# EAGLE design L298_gen_card2007 (EAGLE 4.16)
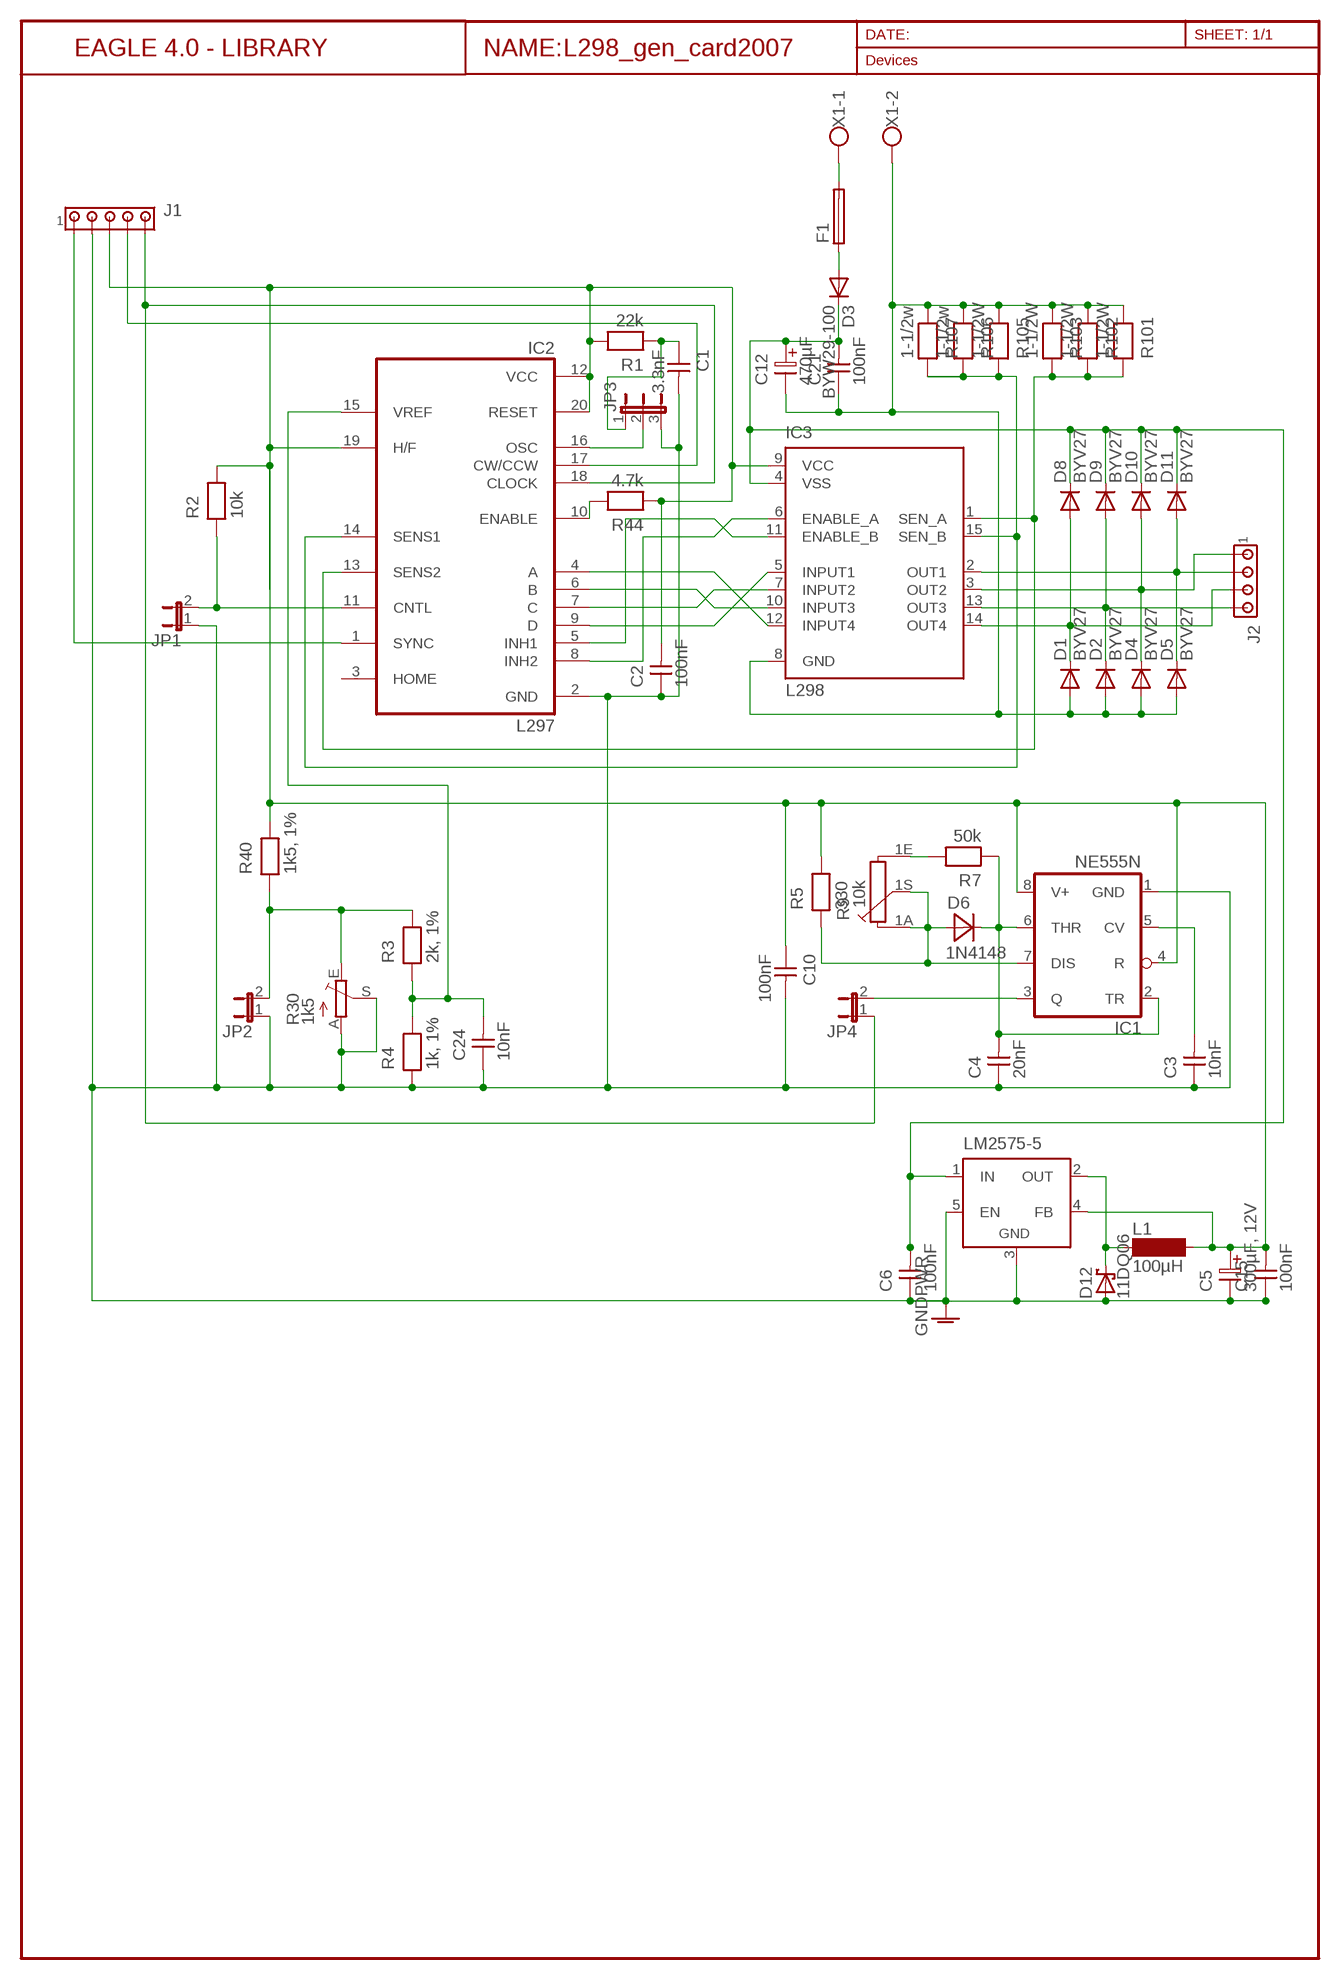
[diagram p0: schematic, sheet 1]

## Parts
C1  3.3nF  CAPNP-5  [C-5]
C2  100nF  CAPNP-5  [C-5]
C3  10nF  CAPNP-5  [C-5]
C4  20nF  CAPNP-5  [C-5]
C5  300µF, 12V  ELC-5  [ES-5]
C6  100nF  CAPNP-5  [C-5]
C10  100nF  CAPNP-5  [C-5]
C12  470µF  ELC-5L  [ES-5L]
C15  100nF  CAPNP-5  [C-5]
C21  100nF  CAPNP-5  [C-5]
C24  10nF  CAPNP-5  [C-5]
D1  BYV27  [SOD57-10]
D2  BYV27  [SOD57-10]
D3  BYW29-100  BYW29  [DO220S]
D4  BYV27  [SOD57-10]
D5  BYV27  [SOD57-10]
D6  1N4148  DIODE-7,5  [D-7,5]
D8  BYV27  [SOD57-10]
D9  BYV27  [SOD57-10]
D10  BYV27  [SOD57-10]
D11  BYV27  [SOD57-10]
D12  11DQ06  SCHOTTKY-DIODEF126Z12  [F126Z12]
F1  TE5  [TE5]
IC1  NE555N  [DIL08]
IC2  L297  [DIL20]
IC3  L298  [MULTIWATT-15]
J1  MTA05-100  [10X05MTA]
J2  MTA04-100  [10X04MTA]
JP1  JP1E  [JP1]
JP2  JP1E  [JP1]
JP3  JP2EROUND  [JP2R]
JP4  JP1E  [JP1]
L1  100µH  BS75  [BS75]
LM2575-5  LM2596TV  [TO220-51]
R1  22k  RESEU-7,5-10  [R-10]
R2  10k  RESEU-10  [R-10]
R3  2k, 1%  RESEU-10  [R-10]
R4  1k, 1%  RESEU-10  [R-10]
R5  330  RESEU-7,5-10  [R-10]
R7  50k  RESEU-7,5-10  [R-10]
R9  10k  PC16S  [PC16S]
R30  1k5  TRIM_EU-S64W  [S64W]
R40  1k5, 1%  RESEU-7,5-10  [R-10]
R44  4.7k  RESEU-7,5-10  [R-10]
R101  1-1/2W  RESEU-10  [R-10]
R102  1-1/2W  RESEU-10  [R-10]
R103  1-1/2W  RESEU-10  [R-10]
R105  1-1/2W  RESEU-10  [R-10]
R106  1-1/2w  RESEU-10  [R-10]
R107  1-1/2w  RESEU-10  [R-10]
X1  AK500/2  [AK500/2]

## Nets
A: D1.C D8.A IC3.14(OUT4) J2.3
B: D2.C D9.A IC3.13(OUT3) J2.4
C: D4.C D10.A IC3.3(OUT2) J2.1
CLK: IC2.18(CLOCK) J1.5 JP4.1
CLOCK: IC1.3(Q) JP4.2
CTRL [MEDIUM]: IC2.11(CNTL) JP1.2 R2.1
CW: IC2.17(CW/CCW) J1.4
D: D5.C D11.A IC3.2(OUT1) J2.2
GND: C1.2 C2.1 C3.1 C4.1 C5.2 C6.1 C10.2 C12.2 C15.1 C21.1 C24.1 D1.A D2.A D4.A D5.A D12.A IC1.1(GND) IC2.2(GND) IC3.8(GND) J1.2 JP1.1 JP2.1 JP3.3 LM2575-5.3(GND) LM2575-5.5(EN) R4.1 R30.A R30.S R101.2 R102.2 R103.2 R105.2 R106.2 R107.2 X1.2 ; supply symbol labelled GNDPWR
INH_1: IC2.5(INH1) IC3.11(ENABLE_B)
INH_2: IC2.8(INH2) IC3.6(ENABLE_A)
N$1: D3.A F1.1
N$2: F1.2 X1.1
N$4: D6.1(A) IC1.7(DIS) R5.1 R9.1A R9.1S
N$9: R7.2 R9.1E
N$10: C3.2 IC1.5(CV)
N$11: IC2.10(ENABLE) R44.2
N$12: IC2.16(OSC) JP3.2
N$15: C1.1 JP3.1 R1.1
N$20: C4.2 D6.2(K) IC1.2(TR) IC1.6(THR) R7.1
N$22: D12.C L1.1 LM2575-5.2(OUT)
SENSE_1: IC2.14(SENS1) IC3.15(SEN_B) R105.1 R106.1 R107.1
SENSE_2: IC2.13(SENS2) IC3.1(SEN_A) R101.1 R102.1 R103.1
SIG_A: IC2.4(A) IC3.12(INPUT4)
SIG_B: IC2.6(B) IC3.10(INPUT3)
SIG_C: IC2.7(C) IC3.7(INPUT2)
SIG_D: IC2.9(D) IC3.5(INPUT1)
SYNC: IC2.1(SYNC) J1.1
VCC [MEDIUM]: C2.2 C5.1 C10.1 C15.2 IC1.4(R) IC1.8(V+) IC2.12(VCC) IC2.19(H/F) IC2.20(RESET) IC3.9(VCC) J1.3 L1.2 LM2575-5.4(FB) R1.2 R2.2 R5.2 R40.2 R44.1
VMES: JP2.2 R3.2 R30.E R40.1
VREF: C24.2 IC2.15(VREF) R3.1 R4.2
VS: C6.2 C12.1 C21.2 D3.C D8.C D9.C D10.C D11.C IC3.4(VSS) LM2575-5.1(IN)
Unconnected: IC2.3(HOME)

## Library data of the parts
C1-C4 C6 C10 C15 C21 C24 = discrete:CAPNP-5
C5 = discrete:ELC-5
C12 = discrete:ELC-5L
D1 D2 D4 D5 D8-D11 = diode:BYV27: DIODE ultra fast
D3 = diode:BYW29: DIODE ultra fast rectifier, 200 V, 8 A
D6 = discrete:DIODE-7,5
D12 = diode:SCHOTTKY-DIODE: Schottky Diode
F1 = fuse:TE5: FUSE Wickmann
IC1 = linear:*555: TIMER
IC2 = st-microelectronics:L297: STEPPER MOTOR CONTROLLER
IC3 = st-microelectronics:L298: DUAL FULL-BRIDGE DRIVER
J1 = con-amp:MTA05-100: AMP connector
J2 = con-amp:MTA04-100: AMP connector
JP1 JP2 JP4 = jumper:JP1E: JUMPER
JP3 = jumper:JP2E: JUMPER
L1 = inductor-neosid:BS: INDUCTOR nominal inductance, magnetically screened
LM2575-5 = linear:LM2596T: STEP-DOWN VOLTAGE REGULATOR
R1 R5 R7 R40 R44 = discrete:RESEU-7,5
R2-R4 R101-R103 R105-R107 = discrete:RESEU-10
R9 = piher:PC16S: POTENTIOMETER single carbon potentiometer, 16 mm, S3ROH
R30 = pot:TRIM_EU-: POTENTIOMETER
X1 = con-ptr500:AK500/2: CONNECTOR

## Net classes
0 default: width 0.508 mm, drill 0.381 mm, clearance 0.508 mm
1 POWER: width 1.676 mm, drill 0.508 mm, clearance 0.762 mm
2 MEDIUM: width 0.813 mm, drill 0.381 mm, clearance 0.635 mm
3 MAXPOWER: width 2.54 mm
4 Text: width 0.102 mm

## Board
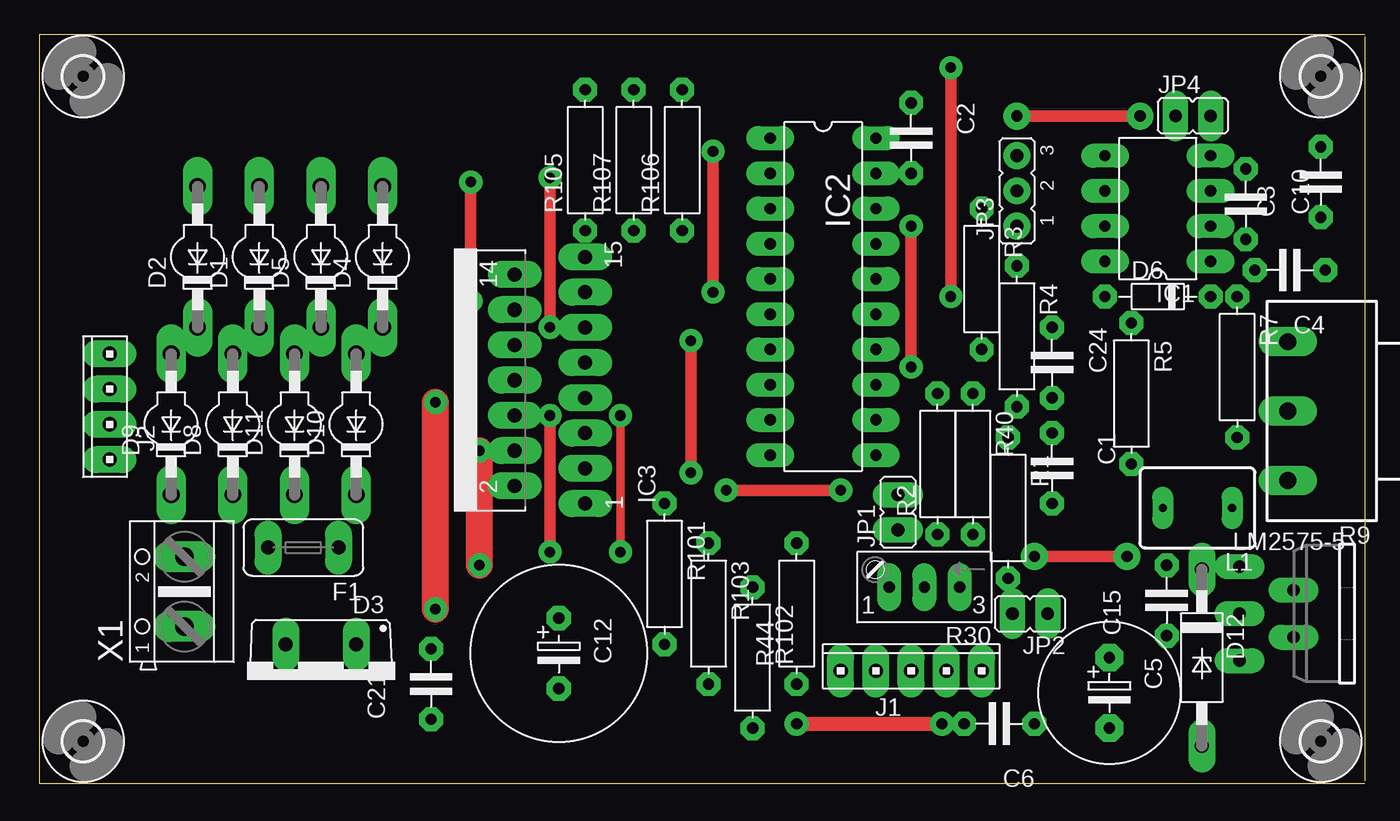
[diagram p1: board, top side]
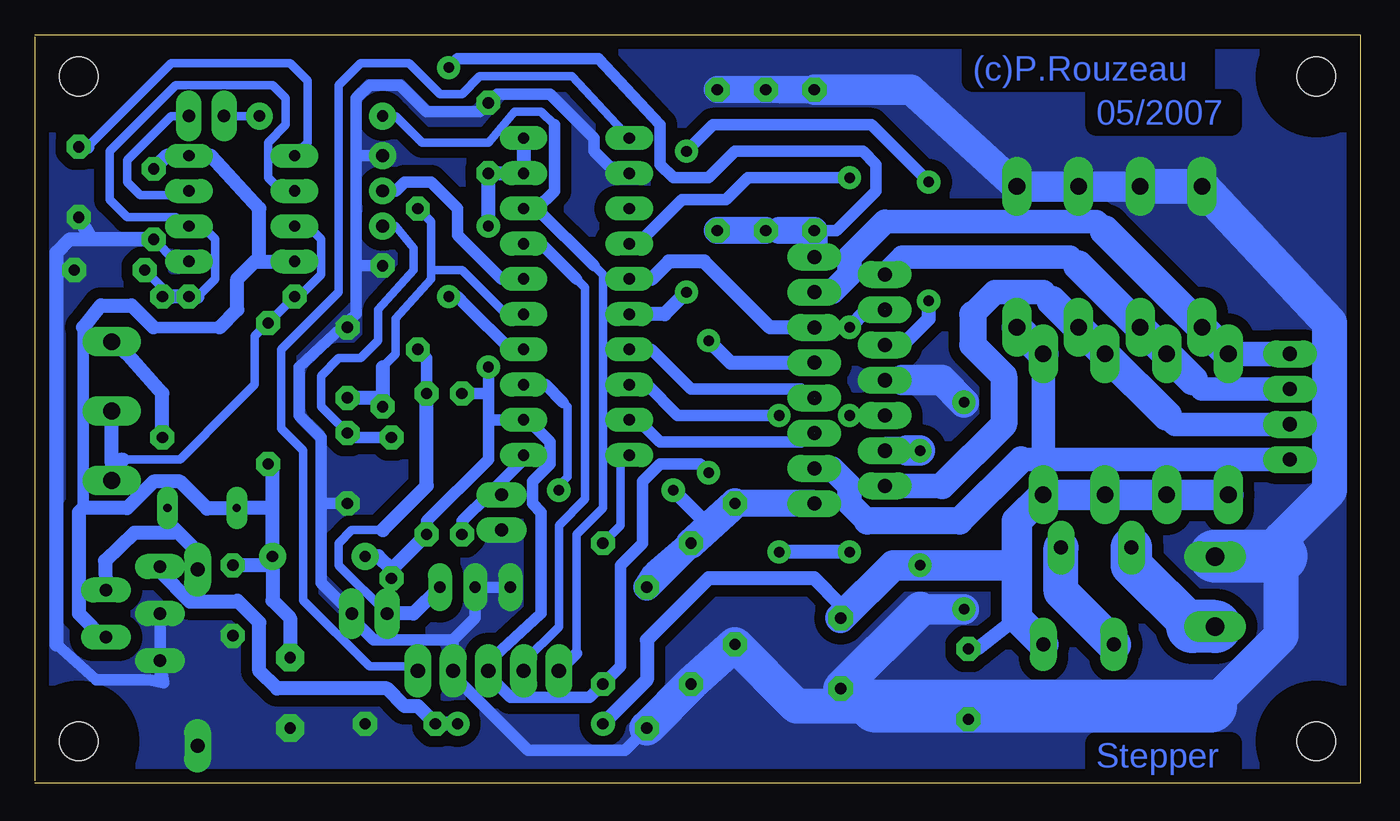
[diagram p2: board, bottom side, seen from below]

Size 95.56 x 53.96 mm. Coordinates in mm from the lower left corner, seen from the top.
Outline: 95.56,0 0,0 0,53.96 95.56,53.96
Outline: 95.56,53.81 95.56,0.15
Copper layers (1*16): Top 0.035mm / dielectric 1.5mm / Bottom 0.035mm
Design rules "default": minimum track width 24mil, minimum drill 30mil, track to track 20mil, track to pad 16mil, pad to pad 16mil, via to via 18mil, smd to smd 15mil, copper to edge 40mil, drill to drill 18mil, minimum pad ring 18mil, minimum via ring 18mil, stop-mask expansion 5mil, vias tented up to drill 0mil, thermal gap 10mil

### Footprints (pad centres in the part's own frame; a part is rotated, then mirrored left to right if it is on the bottom)
C-5 = drill 0.813 pad 1.6 octagon: 1 -2.54,0; 2 2.54,0
ES-5 = drill 0.813 pad 2.007 octagon: 1 -2.54,0; 2 2.54,0
ES-5L = drill 0.813 pad 1.778 octagon: 1 0,0; 2 5.08,0
SOD57-10 = drill 1.194 long: A 5.08,0; C -5.08,0
DO220S = drill 1.016 long: A 2.54,-2.54; C -2.54,-2.54
D-7,5 = drill 0.813 pad 1.6 octagon: 1 -3.81,0; 2 3.81,0
F126Z12 = drill 1.016 long: A 6.35,0; C -6.35,0
TE5 = drill 1.016 long: 1 -2.54,0; 2 2.54,0
DIL08 = drill 0.813 long: 1 -3.81,-3.81; 2 -1.27,-3.81; 3 1.27,-3.81; 4 3.81,-3.81; 5 3.81,3.81; 6 1.27,3.81; 7 -1.27,3.81; 8 -3.81,3.81
DIL20 = drill 0.813 long: 1 -11.43,-3.81; 2 -8.89,-3.81; 3 -6.35,-3.81; 4 -3.81,-3.81; 5 -1.27,-3.81; 6 1.27,-3.81; 7 3.81,-3.81; 8 6.35,-3.81; 9 8.89,-3.81; 10 11.43,-3.81; 11 11.43,3.81; 12 8.89,3.81; 13 6.35,3.81; 14 3.81,3.81; 15 1.27,3.81; 16 -1.27,3.81; 17 -3.81,3.81; 18 -6.35,3.81; 19 -8.89,3.81; 20 -11.43,3.81
MULTIWATT-15 = drill 1.016 long: 1 -8.89,-7.62; 2 -7.62,-2.54; 3 -6.35,-7.62; 4 -5.08,-2.54; 5 -3.81,-7.62; 6 -2.54,-2.54; 7 -1.27,-7.62; 8 0,-2.54; 9 1.27,-7.62; 10 2.54,-2.54; 11 3.81,-7.62; 12 5.08,-2.54; 13 6.35,-7.62; 14 7.62,-2.54; 15 8.89,-7.62
10X05MTA = drill 1.016 long: 1 5.08,0; 2 2.54,0; 3 0,0; 4 -2.54,0; 5 -5.08,0
10X04MTA = drill 1.016 long: 1 -3.81,0; 2 -1.27,0; 3 1.27,0; 4 3.81,0
JP1 = drill 0.914 long: 1 0,-1.27; 2 0,1.27
JP2R = drill 0.914 pad 1.93 round: 1 -2.54,0; 2 0,0; 3 2.54,0
BS75 = drill 0.6 long: 1 -2.5,0; 2 2.5,0
TO220-51 = drill 0.9 long: 1 -3.4,-8.4; 2 -1.7,-4.5; 3 0,-8.4; 4 1.7,-4.5; 5 3.4,-8.4
R-10 = drill 0.813 pad 1.6 octagon: 1 -5.08,0; 2 5.08,0
PC16S = drill 1.2 long: 1A -5,6.5; 1E 5,6.5; 1S 0,6.5
S64W = drill 0.813 long: A 2.54,1.27; E -2.54,1.27; S 0,1.27
2,8 = hole 2.8: 0,0
AK500/2 = drill 1.321 long: 1 -2.515,0; 2 2.515,0

### Placement (x,y rotation side)
C1  73.02,22.7 270 top
C2  62.86,46.51 270 top
C3  92.39,43.33 90 top
C4  90.17,36.98 180 top
C5  77.15,6.5 270 top
C6  69.21,4.28 180 top
C10  86.99,41.75 270 top
C12  37.46,11.9 270 top
C15  81.28,13.17 90 top
C21  28.25,7.14 90 top
C24  73.02,30.32 270 top
D1  15.87,37.94 90 top
D2  11.42,37.94 90 top
D3  20.32,7.46 180 top
D4  24.76,37.94 90 top
D5  20.32,37.94 90 top
D6  80.64,35.08 0 top
D8  13.96,25.87 90 top
D9  9.52,25.87 90 top
D10  22.86,25.87 90 top
D11  18.41,25.87 90 top
D12  83.82,9.04 270 top
F1  19.05,16.98 180 top
IC1  80.64,41.43 90 top
IC2  56.51,35.08 270 top
IC3  31.75,29.05 90 top
J1  62.86,8.09 0 top
J2  5.08,27.14 90 top
JP1  61.91,19.52 0 top
JP2  71.43,12.22 90 top
JP3  70.48,42.7 90 top
JP4  83.18,48.09 270 top
L1  83.5,19.84 180 top
LM2575-5  94.93,12.22 270 top
R1  69.84,19.84 270 top
R2  64.77,23.01 90 top
R3  67.94,36.35 270 top
R4  70.48,32.22 270 top
R5  78.73,28.09 270 top
R7  86.36,30 270 top
R9  96.52,26.82 90 top
R30  63.81,15.39 180 top
R40  67.31,23.01 270 top
R44  54.6,12.22 90 top
R101  45.08,15.07 270 top
R102  51.43,9.04 270 top
R103  48.25,12.22 270 top
R105  39.36,44.92 90 top
R106  46.35,44.92 90 top
R107  42.86,44.92 90 top
U$1  [2,8]  92.39,50.95 270 top
U$2  [2,8]  3.17,3.01 270 top
U$3  [2,8]  92.39,3.01 270 top
U$4  [2,8]  3.17,50.95 270 top
X1  10.47,13.8 90 top

### Tracks (layer width: path | path; a pad name or v marks a point on that pad's centre or on a via)
A
  Bottom 1.676: J2.3 11.42,28.41 12.06,29.05 | 20.31,37.3 20.95,37.94 33.02,37.94 IC3.14
  Bottom 2.184: 12.06,29.05 D8.A D1.C 20.31,37.3
B
  Bottom 1.676: 34.28,40.48 19.05,40.48 18.41,39.84
  Bottom 1.778: IC3.13 38.1,35.4 36.82,36.66 36.82,37.94 34.28,40.48 | J2.4 D9.A
  Bottom 2.184: D2.C D9.A D2.C | D2.C 18.41,39.84
C
  Bottom 1.676: J2.1 22.85,23.33 | 22.85,23.33 24.44,23.33 | 22.85,23.33 D10.A
  Bottom 1.778: IC3.3 38.1,22.69 36.82,21.42 36.82,20.15 35.56,18.89
  Bottom 1.93: 35.56,18.89 28.89,18.89 24.44,23.33
  Bottom 2.184: D10.A D4.C
CLK  (via drill 0.81 pad 1.93)
  Top 0.813: v70.48,48.09 v79.37,48.09
  Bottom 0.61: 55.24,37.3 54.6,36.67 54.6,19.84 56.51,17.93 56.51,9.36 | 58.1,47.46 59.05,48.41 60.96,48.41 62.86,46.19 67.62,46.19 69.53,48.09 v70.48,48.09 | v79.37,48.09 JP4.1
  Bottom 0.813: 55.24,37.3 59.37,41.43 | 59.37,41.43 IC2.18 59.37,41.43 | J1.5 56.51,9.36 | 59.37,41.43 58.1,42.7 58.1,47.46
CLOCK
  Bottom 0.61: IC1.3 84.77,42.7 85.09,42.38 87.94,42.38 88.9,43.33 88.9,44.92 85.72,48.09 JP4.2
CTRL
  Bottom 0.813: IC2.11 60.32,23.33 62.54,21.11 | 62.54,21.11 JP1.2 62.86,20.79 | 62.86,20.79 64.77,18.89 R2.1 | 62.86,20.79 62.54,21.11 | 62.54,21.11
CW
  Bottom 0.61: 56.51,36.35 55.88,35.71 55.88,20.47 57.78,18.57 57.78,11.26 60.32,8.73
  Bottom 0.813: 56.51,36.35 59.05,38.89 IC2.17 | J1.4 60.32,8.73
D
  Bottom 1.676: 13.97,26.51 13.33,25.87 J2.2
  Bottom 1.778: 30.16,21.42 IC3.2 | 22.22,34.76 22.85,35.4 26.35,35.4 27.94,33.81
  Bottom 1.93: 30.16,21.42 25.71,25.87 25.71,29.36 27.94,31.58 27.94,33.81
  Bottom 2.184: 22.22,34.76 D5.C D11.A 13.97,26.51
GND  (via drill 0.76)
  Top 0.61: v28.57,27.46
  Top 1.93: v28.57,12.54 v28.57,27.46 | v28.57,12.54
  Bottom 0.61: 10.47,16.34 X1.2 | IC3.8 33.65,28.41 33.01,29.05 | 26.67,4.28 C21.1 26.67,5.55 | IC1.1 85.4,37.62 C10.2
  Bottom 0.813: R102.2 53.02,2.37 60,2.37 65.08,7.46 | 65.4,10.31 63.81,11.9 R30.S R30.A | 53.34,43.97 53.02,43.65 | 53.34,43.97 53.65,43.97 55.24,45.55 55.24,46.51 58.42,49.68 62.23,49.68 C2.1 63.49,48.41 67.31,48.41 69.21,50.32 71.43,50.32 72.38,49.36 72.38,45.24 | 53.34,43.97 IC2.2 | 72.38,45.24 JP3.3 | J1.2 65.4,10.31 | 65.4,10.31 71.12,10.31 72.39,11.58 JP2.1 74.93,14.44 74.93,20.15 | 74.93,20.15 C1.2 | 74.93,20.15 74.93,24.92 76.51,26.51 76.51,30 72.39,33.81 72.38,37.93 72.39,38.25 72.39,44.92 72.38,45.24 | R4.1 72.07,37.3 | 86.26,7.23 87.31,7.46 91.12,7.46 93.98,9.99 | 86.26,7.23 LM2575-5.5 | LM2575-5.3 86.53,7.92 86.26,7.23
  Bottom 1.016: C3.1 91.43,39.2 C10.2 93.02,39.2 93.98,38.25 93.98,9.99
  Bottom 1.27: 10.5,16.95 10.5,17.01
  Bottom 1.93: IC3.8 33.02,29.05 | 41.91,50 43.81,50 R106.2 | 41.91,50 R107.2 | R105.2 41.91,50 | 41.91,50 R105.2
  Bottom 2.184: v28.57,27.46 | v28.57,27.46 30.16,29.05 33.01,29.05 | 31.74,12.54 v28.57,12.54 | D1.A D5.A D4.A 32.38,50 R105.2
  Bottom 2.54: R102.2 R103.2 R101.2 40.64,5.55 34.92,5.55 C12.2 31.74,12.54 | X1.2 10.5,16.95 | 10.79,5.55 5.71,10.63 5.71,16.34 5.71,17.62 2.22,21.11 2.22,33.17 D2.A D1.A
  Bottom 3.81: 5.71,16.34 10.47,16.34 | 10.79,5.55 26.67,5.55 34.92,5.55
  pour Bottom (isolate 0.813, no thermals): 0.63,0.79 95.25,0.47 95.25,53.81 0.63,54.13
INH_1
  Bottom 1.016: IC3.11 42.54,32.86 47.3,37.62 49.84,37.62 51.11,36.35 IC2.5
INH_2  (via drill 0.76)
  Top 0.61: v41.91,16.66 v41.91,26.51
  Top 0.813: v36.82,16.66 v36.82,26.51
  Bottom 0.813: v41.9,16.66 v41.91,16.66 | v41.91,26.51 49.21,26.51 51.43,28.73 IC2.8 | v36.82,26.51 | v36.82,26.51 IC3.6
  Bottom 1.016: v36.82,16.66 v41.9,16.66
N$1
  Bottom 2.54: F1.1 21.58,13.81 D3.A
N$2
  Bottom 3: 12.09,11.29 16.5,15.71 F1.2
  Bottom 3.81: X1.1 12.09,11.29
N$4
  Bottom 0.61: IC1.7 75.88,40.16 74.93,39.2 74.93,36.66 76.51,35.08 D6.1 R5.1 79.69,32.22 79.69,28.73 81.28,27.14 | 81.28,27.14 85.09,23.33 89.21,23.33 | 81.28,27.14 80.96,27.46
  Bottom 1.016: 90.01,23.18 R9.1A | 90.01,23.18 R9.1S | 89.21,23.33 90.01,23.18
N$9
  Bottom 1.016: R7.2 86.35,28.09 88.82,30.87 R9.1E
N$10
  Bottom 0.61: IC1.5 75.88,46.19 75.88,50.63 77.15,51.9 85.72,51.9 91.75,45.87
  Bottom 1.016: 91.75,45.87 C3.2
N$11
  Bottom 0.61: R44.2 53.34,18.57 53.34,23.01 IC2.10
N$12
  Bottom 0.813: IC2.16 61.91,36.35 65.08,39.52 65.08,41.43 66.99,43.33 68.89,43.33 69.53,42.7 JP3.2
N$15
  Bottom 0.61: C1.1 74.93,27.14 74.93,29.36 73.65,30.63 72.07,30.63 70.8,31.9 70.8,34.12 68.26,36.98 68.26,38.57 69.53,40.16 JP3.1
  Bottom 0.813: R1.1 72.7,24.92 C1.1
N$20
  Bottom 0.61: 85.72,35.08 C4.2 | D6.2 83.82,35.08 82.54,36.35 82.54,39.2 83.5,40.16 IC1.2 | IC1.6 77.78,42.7 78.73,43.65 78.73,46.19 77.46,47.46 77.46,49.37 78.42,50.32 85.4,50.32 90.17,45.55 90.17,42.06 88.9,40.79 85.4,40.79 84.77,40.16
  Bottom 1.016: 83.82,35.08 R7.1 | D6.2 85.72,35.08 | IC1.2 84.77,40.16
N$22
  Bottom 0.813: 90.43,13.86 LM2575-5.2 | 85.4,18.25 85.61,18.05
  Bottom 1.016: 90.43,13.86 90.48,16.03 88.37,18.05 85.61,18.05 | D12.C 83.82,16.66 85.4,18.25 86.04,18.89 L1.1
SENSE_1  (via drill 0.76)
  Top 0.813: v65.72,51.59 v65.72,35.08 | v65.72,35.08
  Bottom 0.762: 41.91,39.84 R107.1 | R105.1
  Bottom 0.813: IC2.14 61.27,31.27 64.45,34.44 65.08,35.08 v65.72,35.08 | v65.72,51.59 65.08,52.22 54.92,52.22 50.48,47.46 50.48,44.6 49.53,43.65 46.98,43.65 45.08,45.55 35.87,45.55 34.92,44.6 34.92,42.7 37.78,39.84 R105.1
  Bottom 1.93: R107.1 R106.1 | R105.1 39.36,39.2 IC3.15 | R105.1 | R105.1 41.91,39.84
SENSE_2  (via drill 0.76)
  Top 0.813: v49.52,21.11 v57.78,21.11
  Bottom 0.61: 57.46,27.46 57.14,27.14 57.14,22.06 57.78,21.43 v57.78,21.11 | 50.79,15.07 50.79,15.08 | 46.67,18.57 46.99,18.89 47.14,18.73
  Bottom 0.813: 57.46,27.46 58.73,28.73 IC2.13 | 50.79,15.08 | R102.1 50.79,15.08 | 47.14,18.73 46.99,18.57
  Bottom 1.016: 47.14,18.73 48.57,20.15 v49.52,21.11
  Bottom 1.93: R103.1 R102.1 50.79,15.07 R103.1 | R103.1 46.67,18.57 R101.1 IC3.1
  Bottom 2.184: R101.1 R103.1
SIG_A  (via drill 0.76)  (1 unrouted)
  Top 0.813: v36.82,32.86 v36.82,43.65
  Bottom 0.61: IC2.4
  Bottom 0.813: v36.82,43.65 44.13,43.65 45.71,42.06 48.89,42.06 52.06,38.89 IC2.4
  Bottom 1.016: v36.82,32.86 | IC3.12 35.56,34.12 v36.82,32.86
SIG_B  (via drill 0.76)
  Top 0.813: v48.57,45.55 v48.57,35.4 | v31.11,34.76 v31.11,43.33
  Bottom 0.813: v31.11,43.33 35.24,47.46 46.67,47.46 v48.57,45.55 | v48.57,45.55
  Bottom 1.016: v48.57,35.4 50.16,33.81 IC2.6 | v31.11,34.76 31.11,34.12 31.11,33.49 33.02,31.58 IC3.10 | v31.11,34.76
SIG_C  (1 unrouted)
  Bottom 0.61: IC2.7
  Bottom 0.813: IC2.7 51.11,31.27 48.25,28.41 40.32,28.41 39.68,27.78 IC3.7
SIG_D  (1 unrouted)
  Bottom 0.813: IC3.5 39.68,25.24 40.32,24.6 50.48,24.6 52.06,26.19 IC2.9
SYNC
  Bottom 0.61: IC2.1 56.83,50.95 63.49,50.95 64.77,49.68 66.35,49.68 68.57,51.9 72.07,51.9 73.65,50.32 73.65,35.4 77.78,31.27 77.78,25.55 76.2,23.96 76.2,13.17 71.43,8.41 68.26,8.41 J1.1
VCC  (via drill 0.76, 0.81 pad 1.93)
  Top 0.813: v62.86,30 v62.86,40.16 | v46.98,22.38 | v46.98,22.38 46.99,31.58 v46.98,31.9 | v71.75,16.34 v78.42,16.34
  Bottom 0.813: 78.42,22.69 R5.2 | IC2.19 IC2.20 | IC2.20 60.32,45.56 | IC2.19 IC2.20 | IC2.19 IC2.20 | IC2.19 IC2.20 | 62.86,26.19 62.86,23.33 67.31,18.89 R40.2 | 62.86,26.19 IC2.12 60,26.19 58.42,24.6 58.42,23.01 59.68,21.74 59.68,20.15 59.05,19.52 59.05,12.22 62.86,8.73 J1.3 62.86,7.77 61.27,6.18 55.56,6.18 R44.1 53.34,8.41 53.34,15.71 51.75,17.3 51.75,21.74 50.48,23.01 47.62,23.01 v46.99,22.38 v46.98,22.38 | 62.86,26.19 62.86,28.09 | 62.86,28.09 v62.86,30 | 62.86,28.09 R2.2 | IC2.20 60.32,45.55 | 69.84,15.39 R1.2 | 86.99,32.86 82.23,32.86 | 92.07,19.84 92.07,32.86
  Bottom 1.016: v62.86,40.16 C2.2 IC2.19 | v46.98,31.9 | v46.98,31.9 46.67,31.58 45.4,30.31 IC3.9 | 60.32,45.55 IC2.19 | R40.2 69.84,15.39 70.8,16.34 v71.75,16.34 | 86.04,45.24 C10.1 | 79.37,37.62 79.37,41.43 82.86,45.24 86.04,45.24 | 86.04,45.24 IC1.4 | 79.37,37.62 IC1.8 | 79.37,37.62 79.69,37.62 80.96,36.35 80.96,34.12 82.23,32.86 | 86.99,32.86 88.58,34.44 90.8,34.44 92.07,32.86 | 78.42,19.84 78.42,22.69 | LM2575-5.4 90.43,10.26 92.39,12.22 92.39,19.52 92.07,19.84 88.9,19.84 86.99,21.74 85.09,21.74 83.14,19.8 | 83.14,19.8 L1.2 | 78.42,19.84 v78.42,16.34 78.42,15.71 | 78.42,19.84 80.96,19.84 83.14,19.8 | 78.42,15.71 C15.2 | 78.42,15.71 78.42,13.17 77.15,11.9 C5.1
VMES
  Bottom 0.61: JP2.2 73.65,15.71 73.65,17.3 72.7,18.25 70.48,18.25
  Bottom 0.813: 67.31,30 67.31,29.05 | 67.31,30 67.31,30.63 R3.2 | R40.1 67.31,30
  Bottom 1.016: R30.E 68.26,12.22 JP2.2 | 70.48,18.25 67.31,21.42 R40.1
VREF
  Bottom 0.61: IC2.15 61.59,33.81 64.77,36.98 66.99,36.98 | 66.99,36.98 66.99,36.35 69.53,33.49 69.53,30.95 70.48,30 | 66.99,36.98 66.99,40.48 R3.1 | 70.48,27.78 R4.2
  Bottom 1.016: 70.48,30 70.48,27.78 C24.2
VS  (via drill 0.76, 0.81)
  Top 0.61: v31.74,23.96 31.74,23.33
  Top 0.762: v31.74,23.96
  Top 1.016: v54.6,4.28 v65.08,4.28
  Top 1.93: v31.74,15.71 v31.74,23.96 | v31.74,23.96
  Bottom 0.813: C12.1 37.46,12.85 | 80.96,13.17 81.05,13.08
  Bottom 1.016: 24.76,11.9 27.62,9.68 C21.2 | LM2575-5.1 86.53,15.25 84.36,13.08 81.05,13.08 | 37.46,12.85 39.36,14.76 46.99,14.76 51.43,10.31 51.43,7.46 v54.6,4.28 | v65.08,4.28 C6.2 67.94,5.55 68.89,5.55 70.16,6.82 78.1,6.82 79.37,8.09 79.37,11.58 80.96,13.17
  Bottom 1.93: 32.7,23.96 IC3.4 | D10.C
  Bottom 2.184: D11.C D10.C | D10.C 24.76,18.89 | 24.76,15.71 24.76,11.9 D3.C | D11.C D8.C D9.C | D10.C 24.76,18.89 | 24.76,18.89 24.76,15.71 | 24.76,15.71 v31.74,15.71 33.65,15.71 C12.1 | v31.74,23.96 32.7,23.96 | D11.C D10.C | D10.C

### Text on the board
Bottom: (c)P.Rouzeau | 05/2007 | Stepper